# EAGLE schematic test-board (EAGLE 6.5.0)
DESIGNER: JONNEW, MWL@MIT; DESIGN_NAME: test-board (2x64_hirose-circular); LICENSE: (c) Jon Newman CC-BY-SA-NC 4.0; REVISION: 1.0
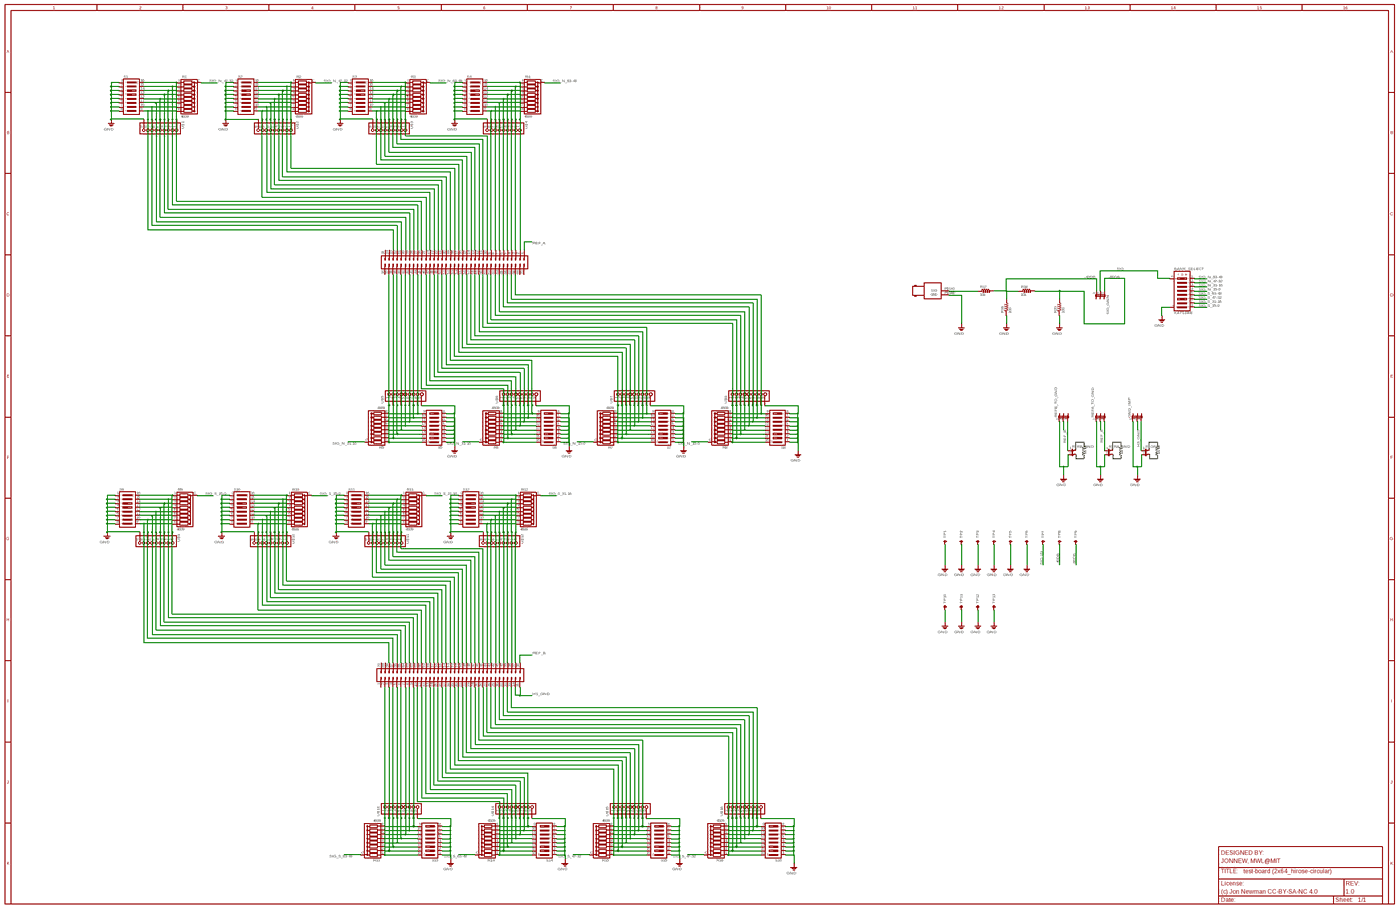
[diagram p0: schematic, sheet 1, overview]
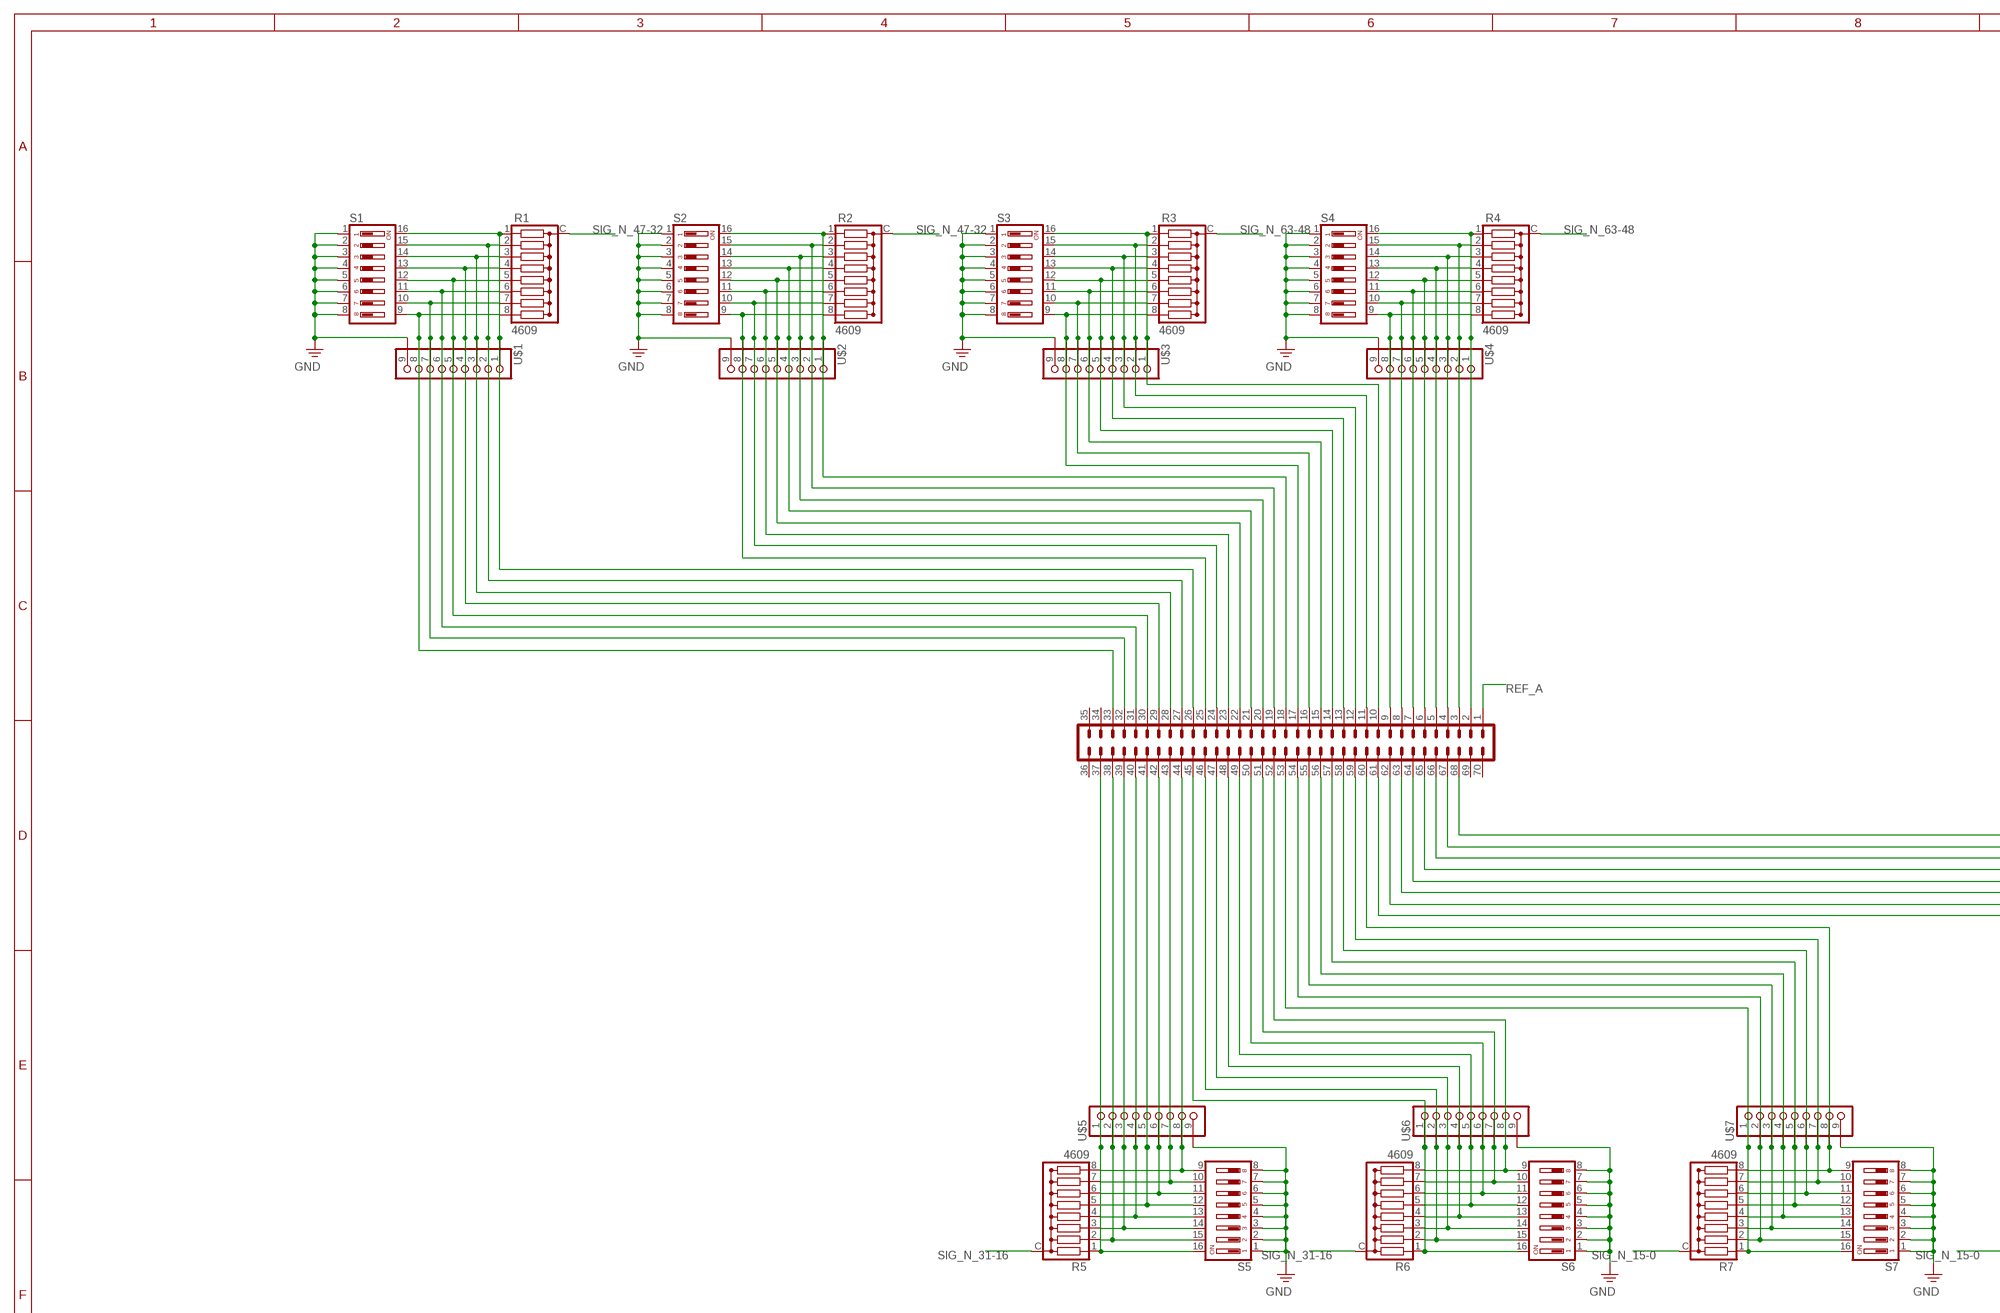
[diagram p1: schematic, sheet 1, part 1 of 4]
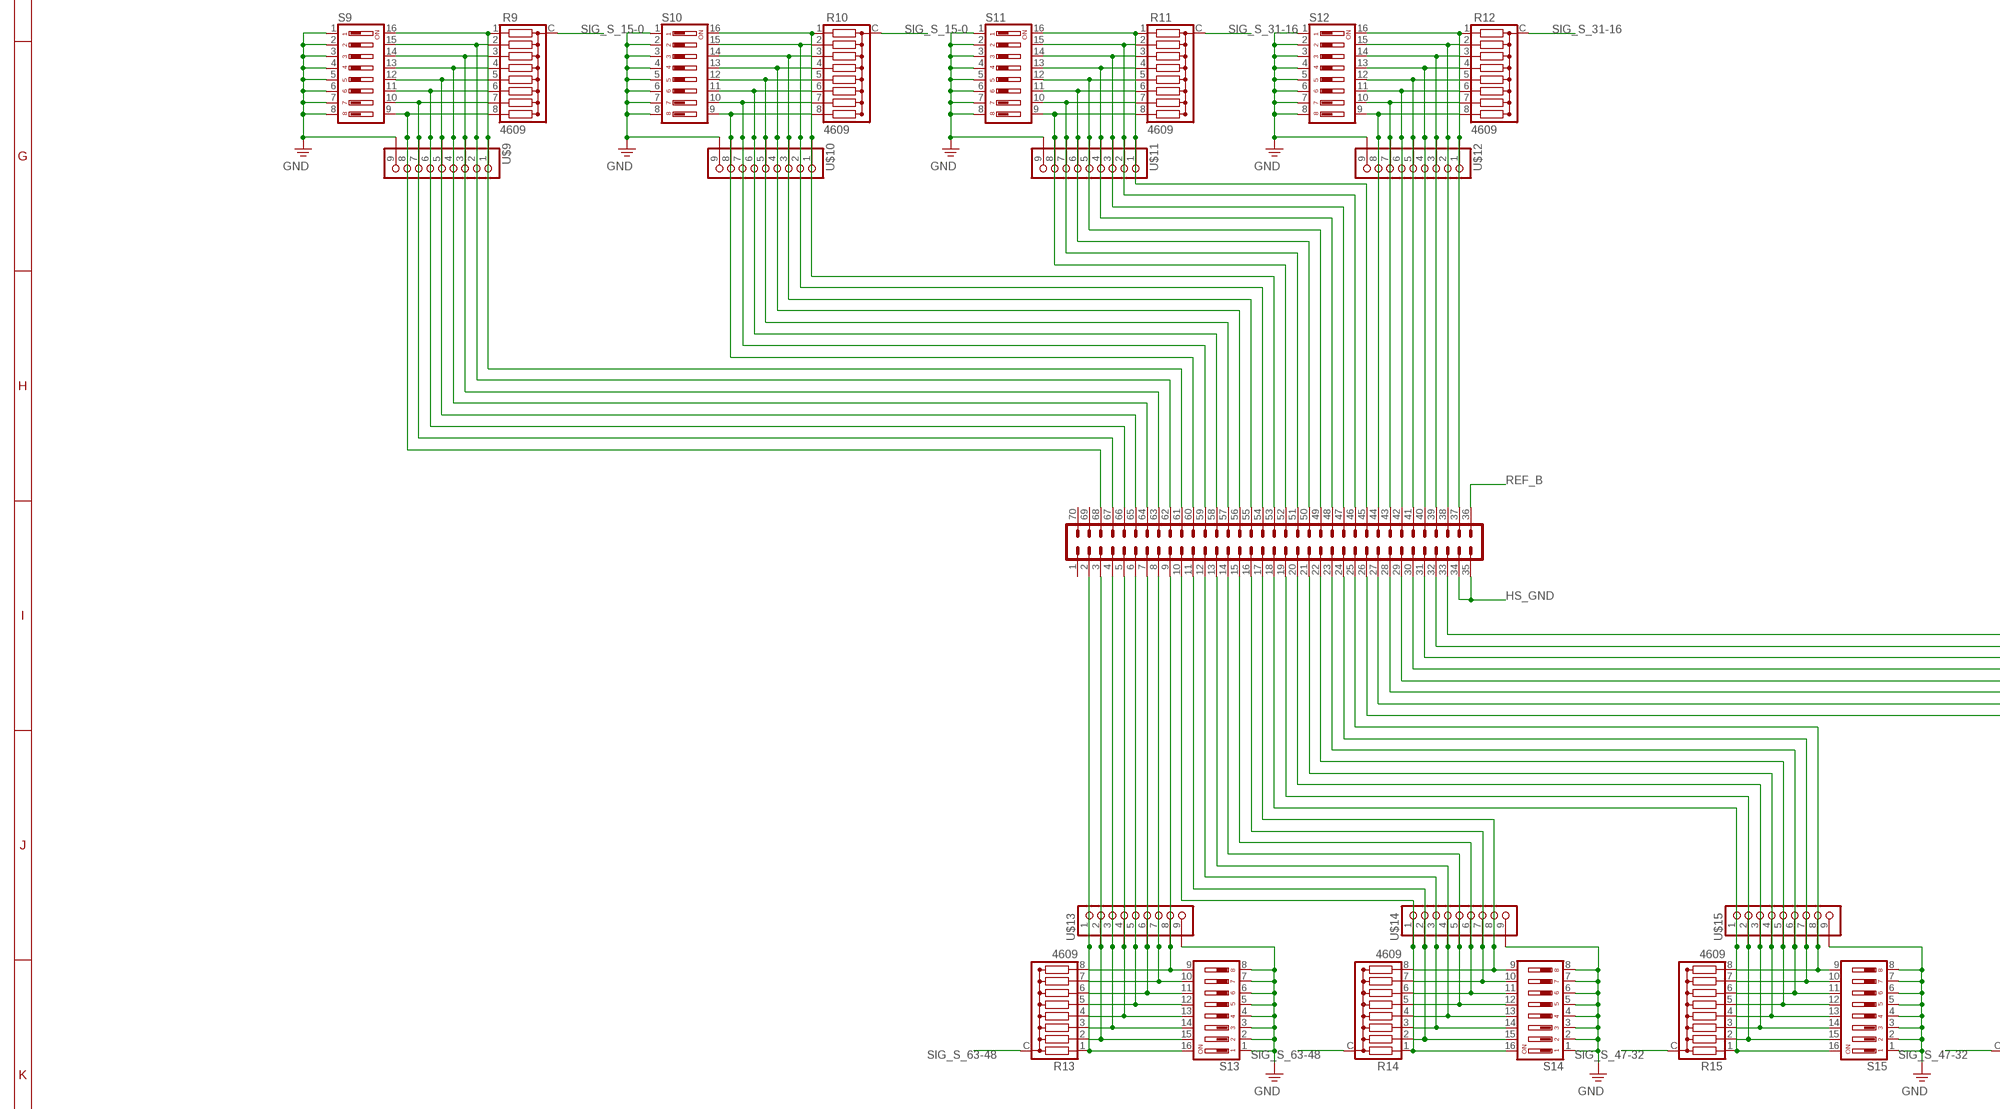
[diagram p2: schematic, sheet 1, part 2 of 4]
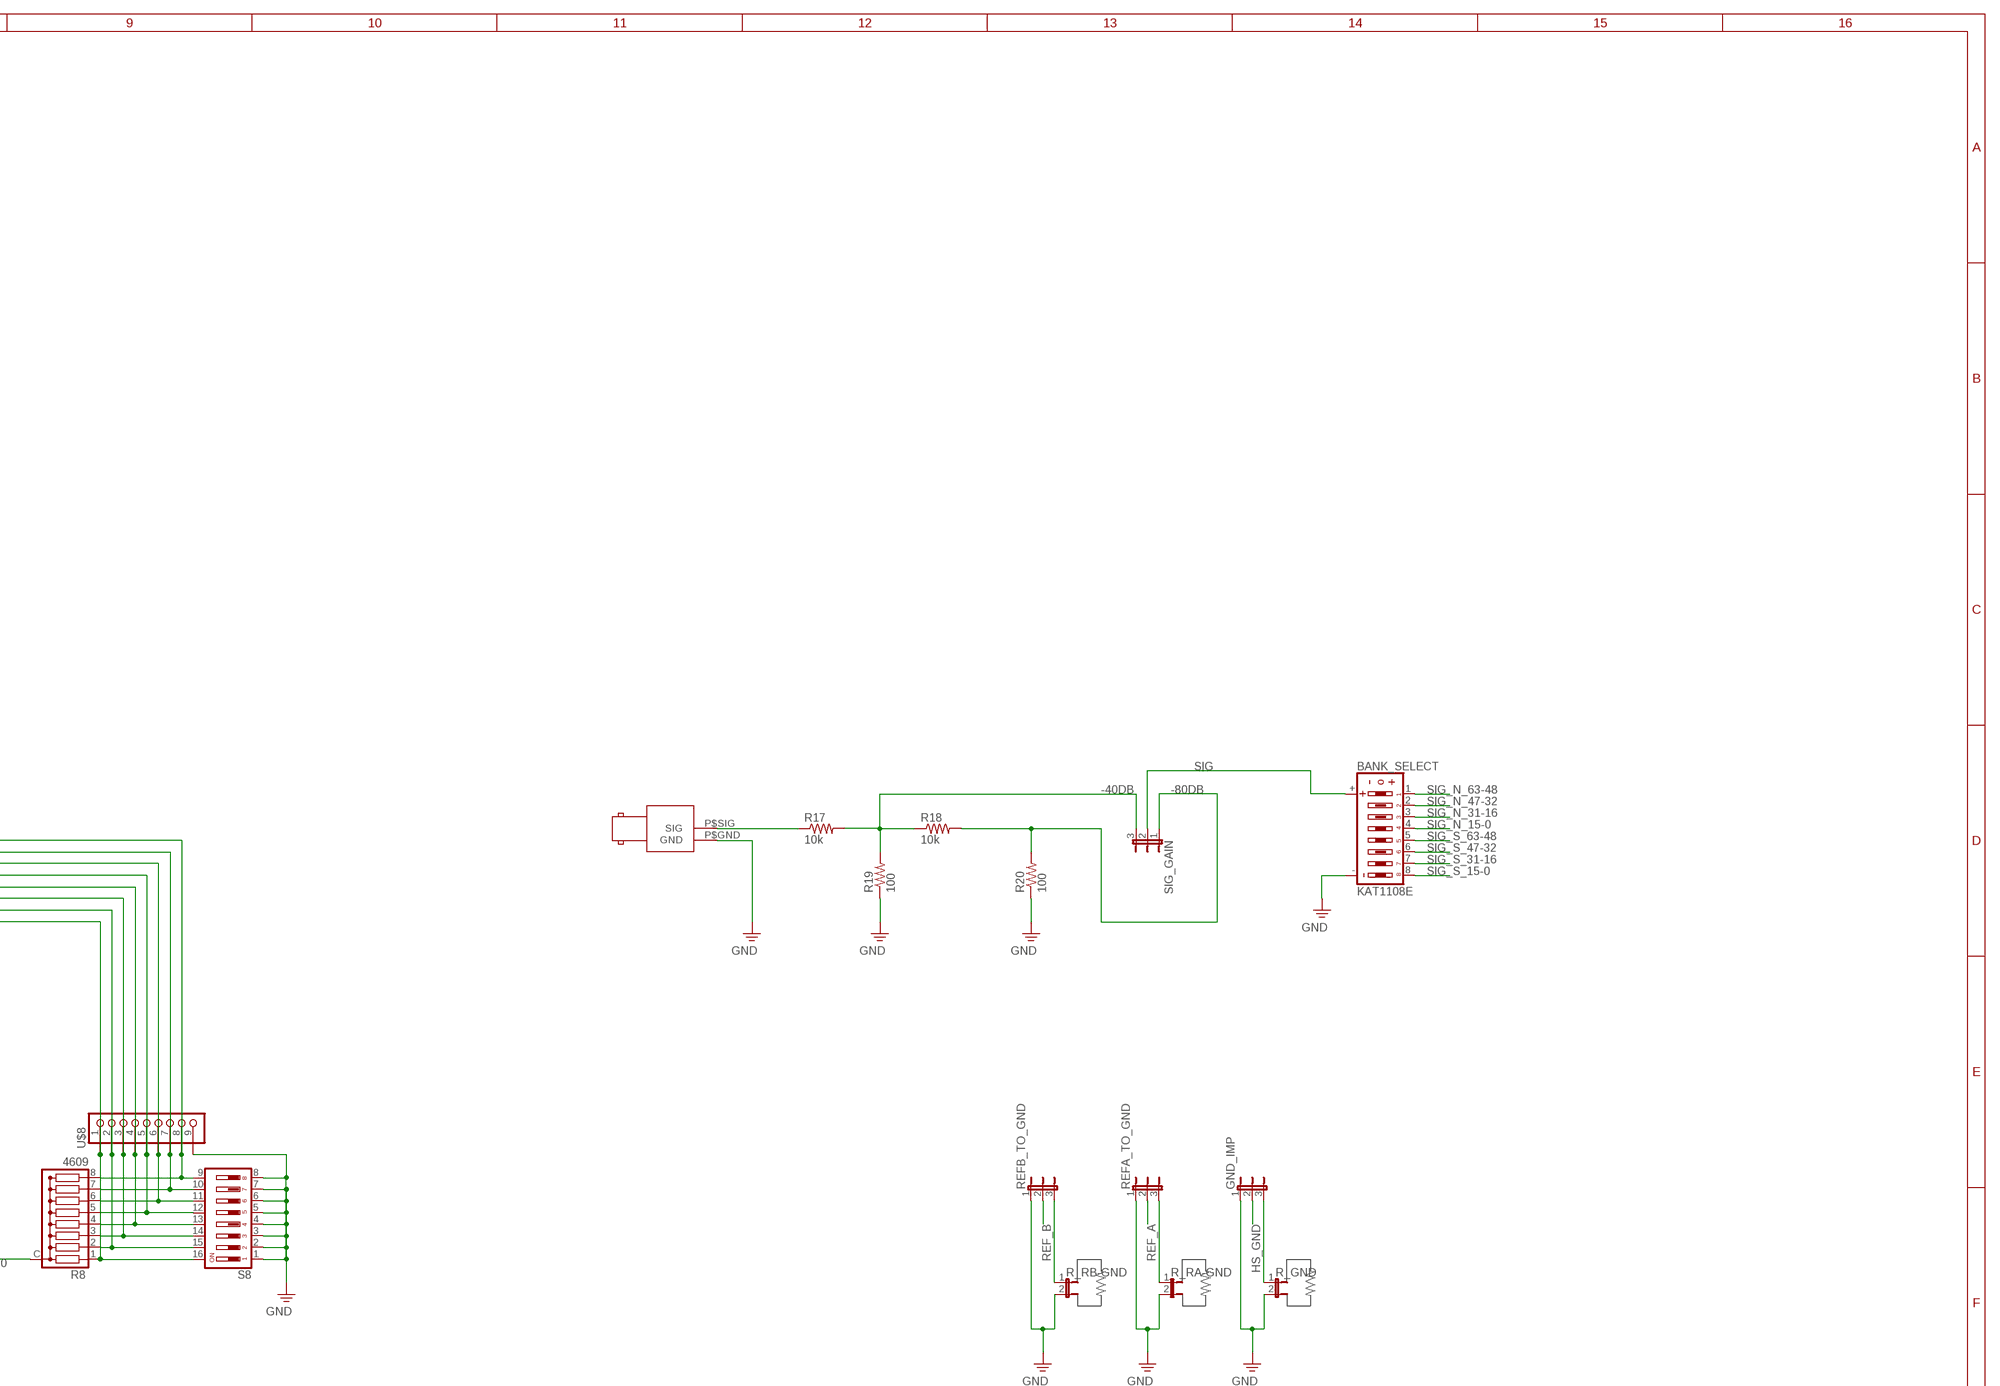
[diagram p3: schematic, sheet 1, part 3 of 4]
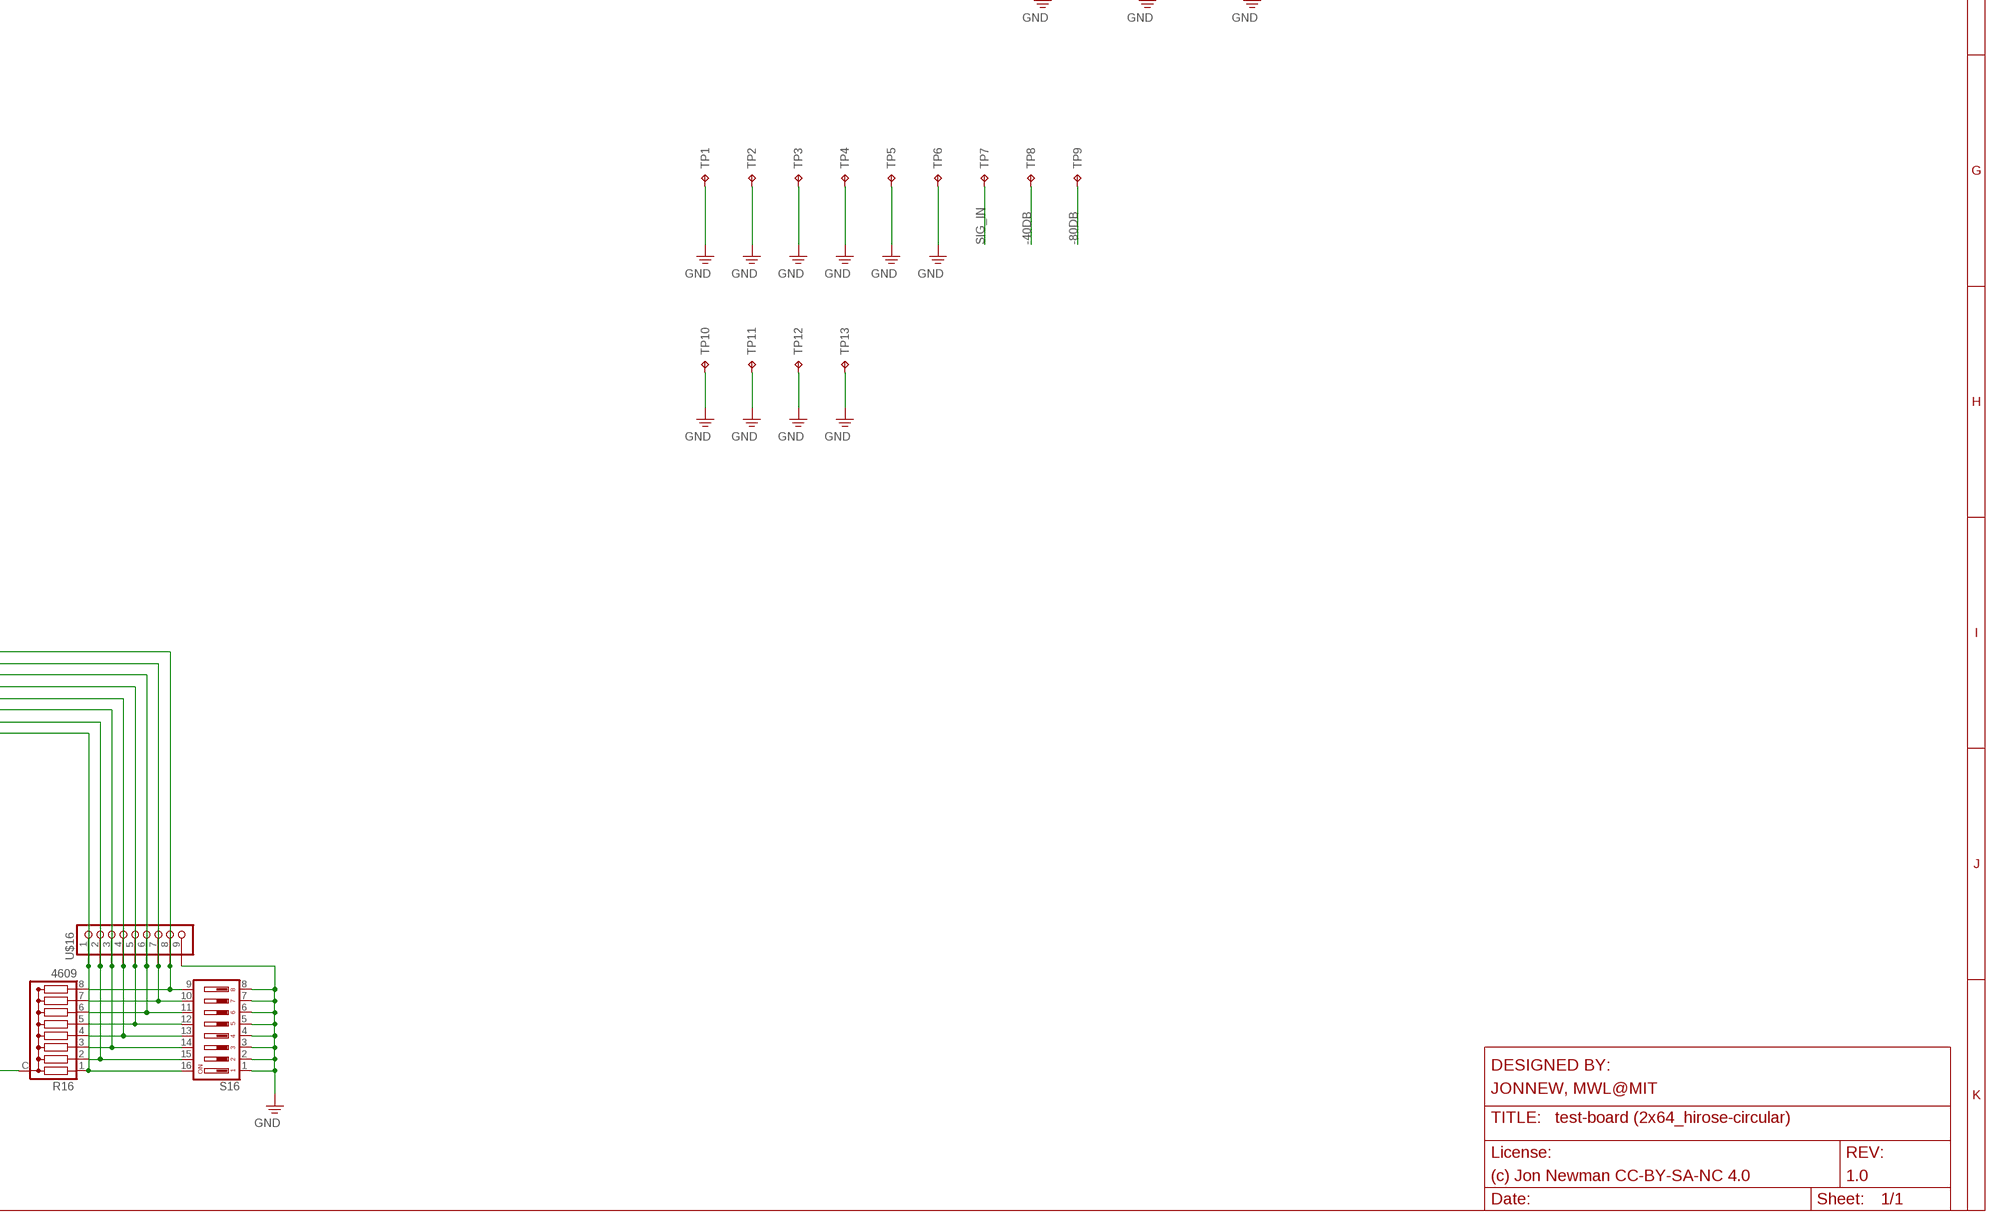
[diagram p4: schematic, sheet 1, part 4 of 4]

## Parts
AIN_N0T  DF40HEAD  PINHD-2X35_DF40HEAD  [DF40-70HEAD]
AIN_S0T  DF40HEAD  PINHD-2X35_DF40HEAD  [DF40-70HEAD]
BANK_SELECT  KAT1108E  DIPSW-008-SPDT_206-124  [206-124_DIP8-SPDT]
GND_IMP  JP3E  [JP3]
R1  4609  RN1X8  [RNX8-0.1]
R2  4609  RN1X8  [RNX8-0.1]
R3  4609  RN1X8  [RNX8-0.1]
R4  4609  RN1X8  [RNX8-0.1]
R5  4609  RN1X8  [RNX8-0.1]
R6  4609  RN1X8  [RNX8-0.1]
R7  4609  RN1X8  [RNX8-0.1]
R8  4609  RN1X8  [RNX8-0.1]
R9  4609  RN1X8  [RNX8-0.1]
R10  4609  RN1X8  [RNX8-0.1]
R11  4609  RN1X8  [RNX8-0.1]
R12  4609  RN1X8  [RNX8-0.1]
R13  4609  RN1X8  [RNX8-0.1]
R14  4609  RN1X8  [RNX8-0.1]
R15  4609  RN1X8  [RNX8-0.1]
R16  4609  RN1X8  [RNX8-0.1]
R17  10k  R_0805  [0805]
R18  10k  R_0805  [0805]
R19  100  R_0805  [0805]
R20  100  R_0805  [0805]
R_GND  JP2E_THRU-HOLE  [JP2]
R_RA-GND  JP2E_THRU-HOLE  [JP2]
R_RB-GND  JP2E_THRU-HOLE  [JP2]
REFA_TO_GND  JP3E  [JP3]
REFB_TO_GND  JP3E  [JP3]
S1  DIPSW-008_ADE  [ADE_DIP8-SPST]
S2  DIPSW-008_ADE  [ADE_DIP8-SPST]
S3  DIPSW-008_ADE  [ADE_DIP8-SPST]
S4  DIPSW-008_ADE  [ADE_DIP8-SPST]
S5  DIPSW-008_ADE  [ADE_DIP8-SPST]
S6  DIPSW-008_ADE  [ADE_DIP8-SPST]
S7  DIPSW-008_ADE  [ADE_DIP8-SPST]
S8  DIPSW-008_ADE  [ADE_DIP8-SPST]
S9  DIPSW-008_ADE  [ADE_DIP8-SPST]
S10  DIPSW-008_ADE  [ADE_DIP8-SPST]
S11  DIPSW-008_ADE  [ADE_DIP8-SPST]
S12  DIPSW-008_ADE  [ADE_DIP8-SPST]
S13  DIPSW-008_ADE  [ADE_DIP8-SPST]
S14  DIPSW-008_ADE  [ADE_DIP8-SPST]
S15  DIPSW-008_ADE  [ADE_DIP8-SPST]
S16  DIPSW-008_ADE  [ADE_DIP8-SPST]
SIG_GAIN  JP3E  [JP3]
SIG_IN  1-1634622-0  BNC_RIGHT_ANGLE  [BNC_RIGHT_ANGLE]
TP1  GND  TPPAD1-20  [P1-20]
TP2  GND  TPPAD1-20  [P1-20]
TP3  GND  TPPAD1-20  [P1-20]
TP4  GND  TPPAD1-20  [P1-20]
TP5  GND  TPPAD1-20  [P1-20]
TP6  GND  TPPAD1-20  [P1-20]
TP7  SIG_IN  TPPAD1-20  [P1-20]
TP8  -40dB  TPPAD1-20  [P1-20]
TP9  -80dB  TPPAD1-20  [P1-20]
TP10  TP_4-40  [4-40_PLATED]
TP11  TP_4-40  [4-40_PLATED]
TP12  TP_4-40  [4-40_PLATED]
TP13  TP_4-40  [4-40_PLATED]
U$1  PINHD-1X9  [1X09]
U$2  PINHD-1X9  [1X09]
U$3  PINHD-1X9  [1X09]
U$4  PINHD-1X9  [1X09]
U$5  PINHD-1X9  [1X09]
U$6  PINHD-1X9  [1X09]
U$7  PINHD-1X9  [1X09]
U$8  PINHD-1X9  [1X09]
U$9  PINHD-1X9  [1X09]
U$10  PINHD-1X9  [1X09]
U$11  PINHD-1X9  [1X09]
U$12  PINHD-1X9  [1X09]
U$13  PINHD-1X9  [1X09]
U$14  PINHD-1X9  [1X09]
U$15  PINHD-1X9  [1X09]
U$16  PINHD-1X9  [1X09]

## Nets
-40DB: R17.2 R18.1 R19.2 SIG_GAIN.3 TP8.TP
-80DB: R18.2 R20.2 SIG_GAIN.1 TP9.TP
GND: BANK_SELECT.- GND_IMP.1 R19.1 R20.1 R_GND.2 R_RA-GND.2 R_RB-GND.2 REFA_TO_GND.1 REFB_TO_GND.1 S1.1 S1.2 S1.3 S1.4 S1.5 S1.6 S1.7 S1.8 S2.1 S2.2 S2.3 S2.4 S2.5 S2.6 S2.7 S2.8 S3.1 S3.2 S3.3 S3.4 S3.5 S3.6 S3.7 S3.8 S4.1 S4.2 S4.3 S4.4 S4.5 S4.6 S4.7 S4.8 S5.1 S5.2 S5.3 S5.4 S5.5 S5.6 S5.7 S5.8 S6.1 S6.2 S6.3 S6.4 S6.5 S6.6 S6.7 S6.8 S7.1 S7.2 S7.3 S7.4 S7.5 S7.6 S7.7 S7.8 S8.1 S8.2 S8.3 S8.4 S8.5 S8.6 S8.7 S8.8 S9.1 S9.2 S9.3 S9.4 S9.5 S9.6 S9.7 S9.8 S10.1 S10.2 S10.3 S10.4 S10.5 S10.6 S10.7 S10.8 S11.1 S11.2 S11.3 S11.4 S11.5 S11.6 S11.7 S11.8 S12.1 S12.2 S12.3 S12.4 S12.5 S12.6 S12.7 S12.8 S13.1 S13.2 S13.3 S13.4 S13.5 S13.6 S13.7 S13.8 S14.1 S14.2 S14.3 S14.4 S14.5 S14.6 S14.7 S14.8 S15.1 S15.2 S15.3 S15.4 S15.5 S15.6 S15.7 S15.8 S16.1 S16.2 S16.3 S16.4 S16.5 S16.6 S16.7 S16.8 SIG_IN.P$GND(GND) TP1.TP TP2.TP TP3.TP TP4.TP TP5.TP TP6.TP TP10.P$1(TP) TP11.P$1(TP) TP12.P$1(TP) TP13.P$1(TP) U$1.9 U$2.9 U$3.9 U$4.9 U$5.9 U$6.9 U$7.9 U$8.9 U$9.9 U$10.9 U$11.9 U$12.9 U$13.9 U$14.9 U$15.9 U$16.9
HS_GND: AIN_S0T.34 AIN_S0T.35 GND_IMP.2
N$2: GND_IMP.3 R_GND.1
N$3: AIN_S0T.3 R13.2 S13.15 U$13.2
N$4: AIN_S0T.5 R13.4 S13.13 U$13.4
N$6: AIN_N0T.17 R3.8 S3.9 U$3.8
N$7: AIN_N0T.9 R4.8 S4.9 U$4.8
N$8: AIN_N0T.15 R3.6 S3.11 U$3.6
N$9: AIN_N0T.14 R3.5 S3.12 U$3.5
N$10: AIN_N0T.3 R4.2 S4.15 U$4.2
N$11: AIN_N0T.12 R3.3 S3.14 U$3.3
N$12: AIN_N0T.4 R4.3 S4.14 U$4.3
N$13: AIN_N0T.10 R3.1 S3.16 U$3.1
N$15: R_RA-GND.1 REFA_TO_GND.3
N$18: AIN_N0T.7 R4.6 S4.11 U$4.6
N$19: AIN_N0T.8 R4.7 S4.10 U$4.7
N$20: AIN_N0T.6 R4.5 S4.12 U$4.5
N$21: AIN_N0T.2 R4.1 S4.16 U$4.1
N$23: AIN_N0T.27 R1.2 S1.15 U$1.2
N$24: AIN_N0T.29 R1.4 S1.13 U$1.4
N$25: AIN_N0T.43 R5.7 S5.10 U$5.7
N$26: AIN_S0T.7 R13.6 S13.11 U$13.6
N$27: AIN_N0T.32 R1.7 S1.10 U$1.7
N$28: R_RB-GND.1 REFB_TO_GND.3
N$29: AIN_N0T.30 R1.5 S1.12 U$1.5
N$30: AIN_N0T.41 R5.5 S5.12 U$5.5
N$31: AIN_N0T.28 R1.3 S1.14 U$1.3
N$32: AIN_S0T.9 R13.8 S13.9 U$13.8
N$33: AIN_N0T.39 R5.3 S5.14 U$5.3
N$34: AIN_N0T.31 R1.6 S1.11 U$1.6
N$35: AIN_S0T.10 R14.1 S14.16 U$14.1
N$36: AIN_N0T.33 R1.8 S1.9 U$1.8
N$37: AIN_N0T.37 R5.1 S5.16 U$5.1
N$38: AIN_N0T.19 R2.2 S2.15 U$2.2
N$39: AIN_N0T.52 R6.8 S6.9 U$6.8
N$40: AIN_N0T.21 R2.4 S2.13 U$2.4
N$41: AIN_S0T.11 R14.2 S14.15 U$14.2
N$42: AIN_N0T.23 R2.6 S2.11 U$2.6
N$43: AIN_N0T.24 R2.7 S2.10 U$2.7
N$45: AIN_S0T.14 R14.5 S14.12 U$14.5
N$46: AIN_S0T.15 R14.6 S14.11 U$14.6
N$47: AIN_N0T.47 R6.3 S6.14 U$6.3
N$48: AIN_S0T.16 R14.7 S14.10 U$14.7
N$49: AIN_S0T.19 R15.2 S15.15 U$15.2
N$50: AIN_S0T.20 R15.3 S15.14 U$15.3
N$51: AIN_S0T.21 R15.4 S15.13 U$15.4
N$52: AIN_S0T.22 R15.5 S15.12 U$15.5
N$53: AIN_S0T.23 R15.6 S15.11 U$15.6
N$54: AIN_S0T.24 R15.7 S15.10 U$15.7
N$55: AIN_S0T.25 R15.8 S15.9 U$15.8
N$56: AIN_S0T.26 R16.1 S16.16 U$16.1
N$57: AIN_N0T.53 R7.1 S7.16 U$7.1
N$58: AIN_S0T.27 R16.2 S16.15 U$16.2
N$59: AIN_S0T.28 R16.3 S16.14 U$16.3
N$60: AIN_S0T.29 R16.4 S16.13 U$16.4
N$61: AIN_S0T.30 R16.5 S16.12 U$16.5
N$62: AIN_S0T.31 R16.6 S16.11 U$16.6
N$63: AIN_S0T.32 R16.7 S16.10 U$16.7
N$64: AIN_S0T.33 R16.8 S16.9 U$16.8
N$65: AIN_S0T.8 R13.7 S13.10 U$13.7
N$66: AIN_S0T.6 R13.5 S13.12 U$13.5
N$67: AIN_S0T.4 R13.3 S13.14 U$13.3
N$68: AIN_S0T.2 R13.1 S13.16 U$13.1
N$69: AIN_S0T.17 R14.8 S14.9 U$14.8
N$70: AIN_S0T.12 R14.3 S14.14 U$14.3
N$71: AIN_S0T.18 R15.1 S15.16 U$15.1
N$72: AIN_S0T.61 R9.1 S9.16 U$9.1
N$73: AIN_S0T.60 R10.8 S10.9 U$10.8
N$74: AIN_S0T.57 R10.5 S10.12 U$10.5
N$75: AIN_S0T.55 R10.3 S10.14 U$10.3
N$76: AIN_S0T.53 R10.1 S10.16 U$10.1
N$77: AIN_S0T.51 R11.7 S11.10 U$11.7
N$78: AIN_S0T.48 R11.4 S11.13 U$11.4
N$79: AIN_S0T.46 R11.2 S11.15 U$11.2
N$80: AIN_S0T.40 R12.4 S12.13 U$12.4
N$81: AIN_S0T.52 R11.8 S11.9 U$11.8
N$82: AIN_S0T.50 R11.6 S11.11 U$11.6
N$83: AIN_S0T.49 R11.5 S11.12 U$11.5
N$84: AIN_S0T.47 R11.3 S11.14 U$11.3
N$85: AIN_S0T.45 R11.1 S11.16 U$11.1
N$86: AIN_S0T.67 R9.7 S9.10 U$9.7
N$87: AIN_S0T.65 R9.5 S9.12 U$9.5
N$88: AIN_S0T.63 R9.3 S9.14 U$9.3
N$89: AIN_S0T.44 R12.8 S12.9 U$12.8
N$90: AIN_S0T.38 R12.2 S12.15 U$12.2
N$91: AIN_S0T.39 R12.3 S12.14 U$12.3
N$92: AIN_S0T.42 R12.6 S12.11 U$12.6
N$93: AIN_S0T.43 R12.7 S12.10 U$12.7
N$94: AIN_S0T.41 R12.5 S12.12 U$12.5
N$95: AIN_S0T.37 R12.1 S12.16 U$12.1
N$97: AIN_S0T.64 R9.4 S9.13 U$9.4
N$98: AIN_S0T.66 R9.6 S9.11 U$9.6
N$99: AIN_S0T.68 R9.8 S9.9 U$9.8
N$100: AIN_S0T.54 R10.2 S10.15 U$10.2
N$101: AIN_S0T.56 R10.4 S10.13 U$10.4
N$102: AIN_S0T.58 R10.6 S10.11 U$10.6
N$103: AIN_S0T.59 R10.7 S10.10 U$10.7
N$110: AIN_S0T.13 R14.4 S14.13 U$14.4
N$130: AIN_S0T.62 R9.2 S9.15 U$9.2
N$206: AIN_N0T.26 R1.1 S1.16 U$1.1
N$207: AIN_N0T.25 R2.8 S2.9 U$2.8
N$210: AIN_N0T.22 R2.5 S2.12 U$2.5
N$212: AIN_N0T.20 R2.3 S2.14 U$2.3
N$214: AIN_N0T.18 R2.1 S2.16 U$2.1
N$216: AIN_N0T.16 R3.7 S3.10 U$3.7
N$219: AIN_N0T.13 R3.4 S3.13 U$3.4
N$221: AIN_N0T.11 R3.2 S3.15 U$3.2
N$230: AIN_N0T.5 R4.4 S4.13 U$4.4
N$231: AIN_N0T.38 R5.2 S5.15 U$5.2
N$233: AIN_N0T.40 R5.4 S5.13 U$5.4
N$235: AIN_N0T.42 R5.6 S5.11 U$5.6
N$237: AIN_N0T.44 R5.8 S5.9 U$5.8
N$238: AIN_N0T.45 R6.1 S6.16 U$6.1
N$239: AIN_N0T.46 R6.2 S6.15 U$6.2
N$241: AIN_N0T.48 R6.4 S6.13 U$6.4
N$242: AIN_N0T.49 R6.5 S6.12 U$6.5
N$243: AIN_N0T.50 R6.6 S6.11 U$6.6
N$245: AIN_N0T.51 R6.7 S6.10 U$6.7
N$247: AIN_N0T.54 R7.2 S7.15 U$7.2
N$248: AIN_N0T.55 R7.3 S7.14 U$7.3
N$249: AIN_N0T.56 R7.4 S7.13 U$7.4
N$250: AIN_N0T.57 R7.5 S7.12 U$7.5
N$251: AIN_N0T.58 R7.6 S7.11 U$7.6
N$252: AIN_N0T.59 R7.7 S7.10 U$7.7
N$253: AIN_N0T.60 R7.8 S7.9 U$7.8
N$254: AIN_N0T.61 R8.1 S8.16 U$8.1
N$255: AIN_N0T.62 R8.2 S8.15 U$8.2
N$256: AIN_N0T.63 R8.3 S8.14 U$8.3
N$257: AIN_N0T.64 R8.4 S8.13 U$8.4
N$258: AIN_N0T.65 R8.5 S8.12 U$8.5
N$259: AIN_N0T.66 R8.6 S8.11 U$8.6
N$260: AIN_N0T.67 R8.7 S8.10 U$8.7
N$261: AIN_N0T.68 R8.8 S8.9 U$8.8
REF_A: AIN_N0T.1 REFA_TO_GND.2
REF_B: AIN_S0T.36 REFB_TO_GND.2
SIG: BANK_SELECT.+ SIG_GAIN.2
SIG_IN: R17.1 SIG_IN.P$SIG(SIG) TP7.TP
SIG_N_15-0: BANK_SELECT.4 R7.C R8.C
SIG_N_31-16: BANK_SELECT.3 R5.C R6.C
SIG_N_47-32: BANK_SELECT.2 R1.C R2.C
SIG_N_63-48: BANK_SELECT.1 R3.C R4.C
SIG_S_15-0: BANK_SELECT.8 R9.C R10.C
SIG_S_31-16: BANK_SELECT.7 R11.C R12.C
SIG_S_47-32: BANK_SELECT.6 R15.C R16.C
SIG_S_63-48: BANK_SELECT.5 R13.C R14.C
Unconnected: AIN_N0T.34 AIN_N0T.35 AIN_N0T.36 AIN_N0T.69 AIN_N0T.70 AIN_S0T.1 AIN_S0T.69 AIN_S0T.70

## Library data of the parts
AIN_N0T AIN_S0T = jonnew:PINHD-2X35
BANK_SELECT = jonnew:DIPSW-008-SPDT
GND_IMP REFA_TO_GND REFB_TO_GND SIG_GAIN = jonnew:JP3E
R1-R16 = jonnew:RN1X8
R17-R20 = jonnew:R: Resistor
R_GND R_RA-GND R_RB-GND = jonnew:JP2E
S1-S16 = jonnew:DIPSW-008
SIG_IN = josh:BNC_RIGHT_ANGLE
TP1-TP13 = jonnew:TP: Test pad
U$1-U$16 = test-board:PINHD-1X9

## Net classes
1 thick: width 0.102 mm